# EAGLE schematic led_driver_board (EAGLE 6.5.0)
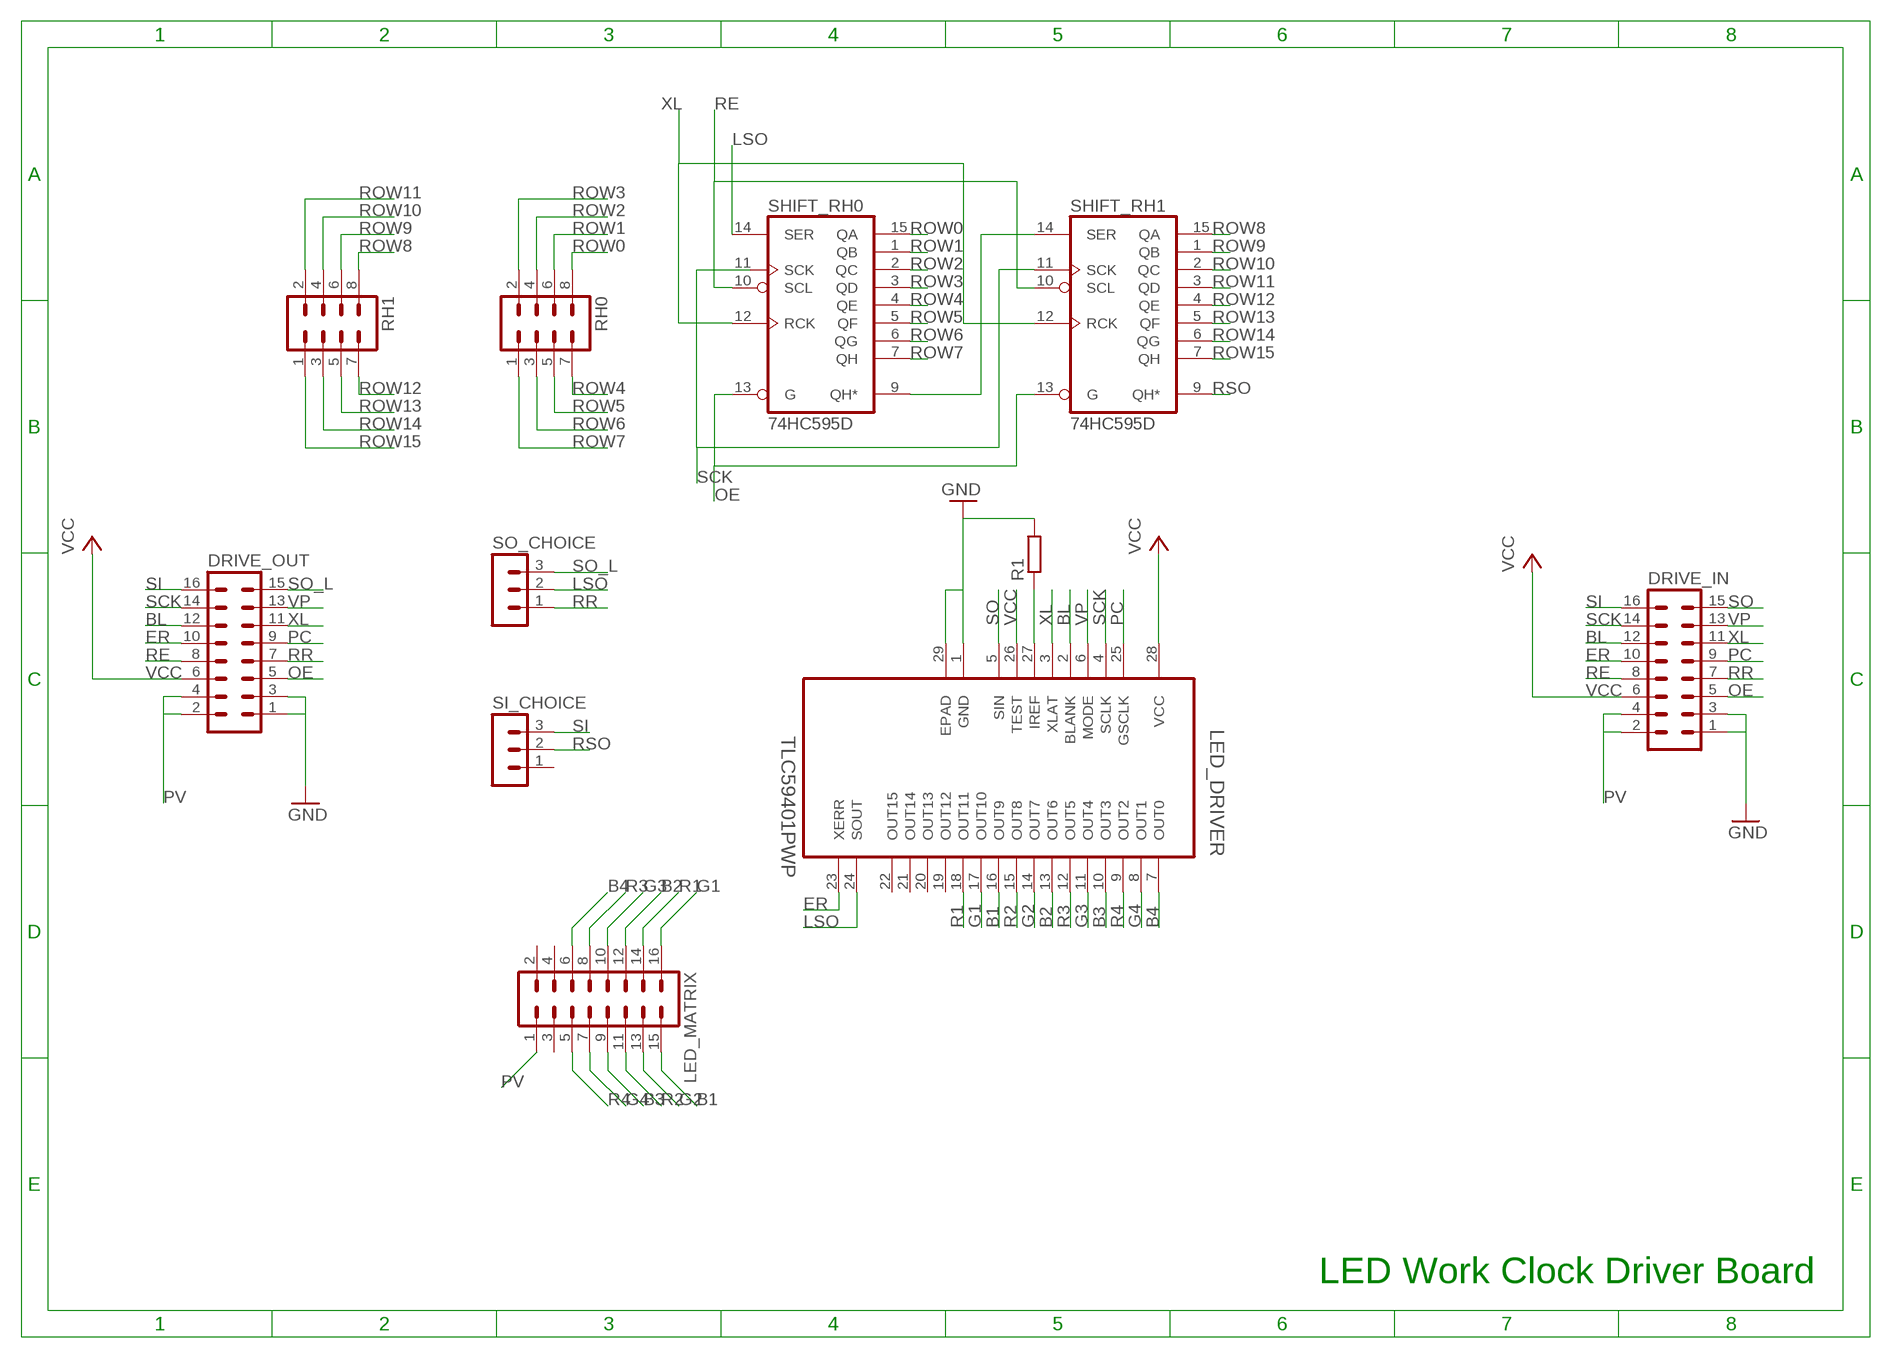
[diagram p0: schematic, sheet 1]

## Parts
DRIVE_IN  MA08-2  [MA08-2]
DRIVE_OUT  MA08-2  [MA08-2]
LED_DRIVER  TLC59401PWP  [SOP65P640X120-29N]
LED_MATRIX  MA08-2  [MA08-2]
R1  R-EU_0204/7  [0204/7]
RH0  MA04-2  [MA04-2]
RH1  MA04-2  [MA04-2]
SHIFT_RH0  74HC595D  [SO16]
SHIFT_RH1  74HC595D  [SO16]
SI_CHOICE  MA03-1  [MA03-1]
SO_CHOICE  MA03-1  [MA03-1]

## Nets
B1: LED_DRIVER.16(OUT9) LED_MATRIX.15
B2: LED_DRIVER.13(OUT6) LED_MATRIX.12
B3: LED_DRIVER.10(OUT3) LED_MATRIX.9
B4: LED_DRIVER.7(OUT0) LED_MATRIX.6
BL: DRIVE_IN.12 DRIVE_OUT.12 LED_DRIVER.2(BLANK)
ER: DRIVE_IN.10 DRIVE_OUT.10 LED_DRIVER.23(XERR)
G1: LED_DRIVER.17(OUT10) LED_MATRIX.16
G2: LED_DRIVER.14(OUT7) LED_MATRIX.13
G3: LED_DRIVER.11(OUT4) LED_MATRIX.10
G4: LED_DRIVER.8(OUT1) LED_MATRIX.7
GND: DRIVE_IN.1 DRIVE_IN.3 DRIVE_OUT.1 DRIVE_OUT.3 LED_DRIVER.1(GND) LED_DRIVER.29(EPAD) R1.2
LSO: LED_DRIVER.24(SOUT) SHIFT_RH0.14(SER) SO_CHOICE.2
N$1: LED_DRIVER.27(IREF) R1.1
N$9: SHIFT_RH0.9(QH*) SHIFT_RH1.14(SER)
OE: DRIVE_IN.5 DRIVE_OUT.5 SHIFT_RH0.13(G) SHIFT_RH1.13(G)
PC: DRIVE_IN.9 DRIVE_OUT.9 LED_DRIVER.25(GSCLK)
PV: DRIVE_IN.2 DRIVE_IN.4 DRIVE_OUT.2 DRIVE_OUT.4 LED_MATRIX.1
R1: LED_DRIVER.18(OUT11) LED_MATRIX.14
R2: LED_DRIVER.15(OUT8) LED_MATRIX.11
R3: LED_DRIVER.12(OUT5) LED_MATRIX.8
R4: LED_DRIVER.9(OUT2) LED_MATRIX.5
RE: DRIVE_IN.8 DRIVE_OUT.8 SHIFT_RH0.10(SCL) SHIFT_RH1.10(SCL)
ROW0: RH0.8 SHIFT_RH0.15(QA)
ROW1: RH0.6 SHIFT_RH0.1(QB)
ROW2: RH0.4 SHIFT_RH0.2(QC)
ROW3: RH0.2 SHIFT_RH0.3(QD)
ROW4: RH0.7 SHIFT_RH0.4(QE)
ROW5: RH0.5 SHIFT_RH0.5(QF)
ROW6: RH0.3 SHIFT_RH0.6(QG)
ROW7: RH0.1 SHIFT_RH0.7(QH)
ROW8: RH1.8 SHIFT_RH1.15(QA)
ROW9: RH1.6 SHIFT_RH1.1(QB)
ROW10: RH1.4 SHIFT_RH1.2(QC)
ROW11: RH1.2 SHIFT_RH1.3(QD)
ROW12: RH1.7 SHIFT_RH1.4(QE)
ROW13: RH1.5 SHIFT_RH1.5(QF)
ROW14: RH1.3 SHIFT_RH1.6(QG)
ROW15: RH1.1 SHIFT_RH1.7(QH)
RR: DRIVE_IN.7 DRIVE_OUT.7 SO_CHOICE.1
RSO: SHIFT_RH1.9(QH*) SI_CHOICE.2
SCK: DRIVE_IN.14 DRIVE_OUT.14 LED_DRIVER.4(SCLK) SHIFT_RH0.11(SCK) SHIFT_RH1.11(SCK)
SI: DRIVE_IN.16 DRIVE_OUT.16 SI_CHOICE.3
SO: DRIVE_IN.15 LED_DRIVER.5(SIN)
SO_L: DRIVE_OUT.15 SO_CHOICE.3
VCC: DRIVE_IN.6 DRIVE_OUT.6 LED_DRIVER.26(TEST) LED_DRIVER.28(VCC)
VP: DRIVE_IN.13 DRIVE_OUT.13 LED_DRIVER.6(MODE)
XL: DRIVE_IN.11 DRIVE_OUT.11 LED_DRIVER.3(XLAT) SHIFT_RH0.12(RCK) SHIFT_RH1.12(RCK)
Unconnected: LED_DRIVER.19(OUT12) LED_DRIVER.20(OUT13) LED_DRIVER.21(OUT14) LED_DRIVER.22(OUT15) LED_MATRIX.2 LED_MATRIX.3 LED_MATRIX.4 SI_CHOICE.1

## Notes on the sheet
- LED Work Clock Driver Board

## Power pins joined to a net without a drawn wire
GND: SHIFT_RH0.8(GND) SHIFT_RH1.8(GND)
VCC: SHIFT_RH0.16(VCC) SHIFT_RH1.16(VCC)

## Library data of the parts
DRIVE_IN DRIVE_OUT LED_MATRIX = con-lstb:MA08-2: PIN HEADER; OC_FARNELL: unknown; OC_NEWARK: unknown
LED_DRIVER = Texas Instruments_By_element14_Batch_1:TLC59401PWP: 16-CHANNEL LED DRIVER; MPN: TLC59401PWP; OC_FARNELL: -; OC_NEWARK: 64R0661; PACKAGE: TSSOP-28; SUPPLIER: Texas Instruments
R1 = resistor:R-EU_: RESISTOR, European symbol
RH0 RH1 = con-lstb:MA04-2: PIN HEADER; OC_FARNELL: unknown; OC_NEWARK: unknown
SHIFT_RH0 SHIFT_RH1 = 74xx-eu:74*595: 8-bit SHIFT REGISTER, output latch
SI_CHOICE SO_CHOICE = con-lstb:MA03-1: PIN HEADER; OC_FARNELL: unknown; OC_NEWARK: unknown

## Net classes
0 default: width 0.356 mm, clearance 0.191 mm